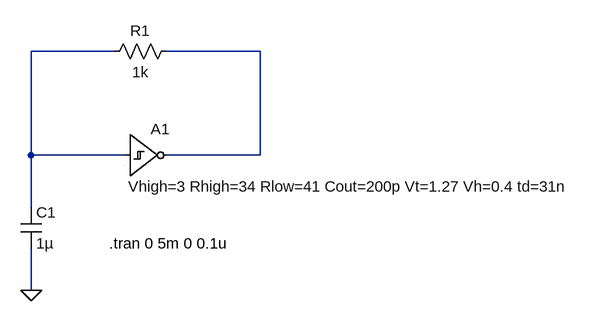
[diagram p0: schematic W2.asc]
W2.asc, the LTspice schematic file:
Version 4
SHEET 1 880 680
WIRE -16 16 -144 16
WIRE 208 16 64 16
WIRE -144 176 -144 16
WIRE 0 176 -144 176
WIRE 208 176 208 16
WIRE 208 176 64 176
WIRE -144 256 -144 176
WIRE -144 384 -144 320
FLAG -144 384 0
SYMBOL Res 80 0 R90
WINDOW 0 0 56 VBottom 2
WINDOW 3 32 56 VTop 2
SYMATTR InstName R1
SYMATTR Value 1k
SYMBOL Digital/schmtinv 0 112 R0
WINDOW 3 5 112 Left 2
SYMATTR InstName A1
SYMATTR Value Vhigh=3 Rhigh=34 Rlow=41 Cout=200p Vt=1.27 Vh=0.4 td=31n
SYMBOL Cap -160 256 R0
SYMATTR InstName C1
SYMATTR Value 1µ
TEXT -24 312 Left 2 !.tran 0 5m 0 0.1u

The netlist it stands for:
* W2.asc
R1 N002 N001 1k
A1 N001 0 0 0 0 N002 0 0 SCHMITT Vhigh=3 Rhigh=34 Rlow=41 Cout=200p Vt=1.27 Vh=0.4 td=31n
C1 N001 0 1µ
.tran 0 5m 0 0.1u
.backanno
.end